# Altium schematic sheet lv_io_top_level.SchDoc
size A4; Organization: Badgerloop; Address1: 133 Engineering Research; Address2: Building; Address3: Madison, WI 53715
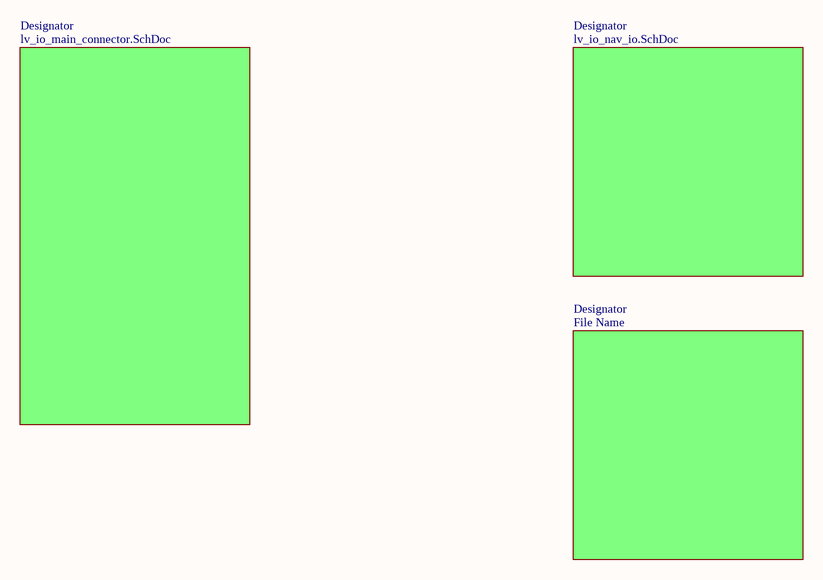
[diagram p0: lv_io_top_level.SchDoc]

## Sub-sheets
Designator = lv_io_main_connector.SchDoc: no entries
Designator = lv_io_nav_io.SchDoc: no entries
Designator = File Name: no entries

## Notes on the sheet
- Title
- Size:
- Date:
- A4
- Number:
- Time:
- Revision:
- Sheet
- of
- File: